# Altium schematic sheet MAIN.SchDoc: Main
size 431 x 279 mm; Date: 02/15/2021; CompanyName: University of Pennsylvania; DrawnBy: Team KOIN; DocumentNumber: 1; Revision: 2; SheetNumber: 1; SheetTotal: 8
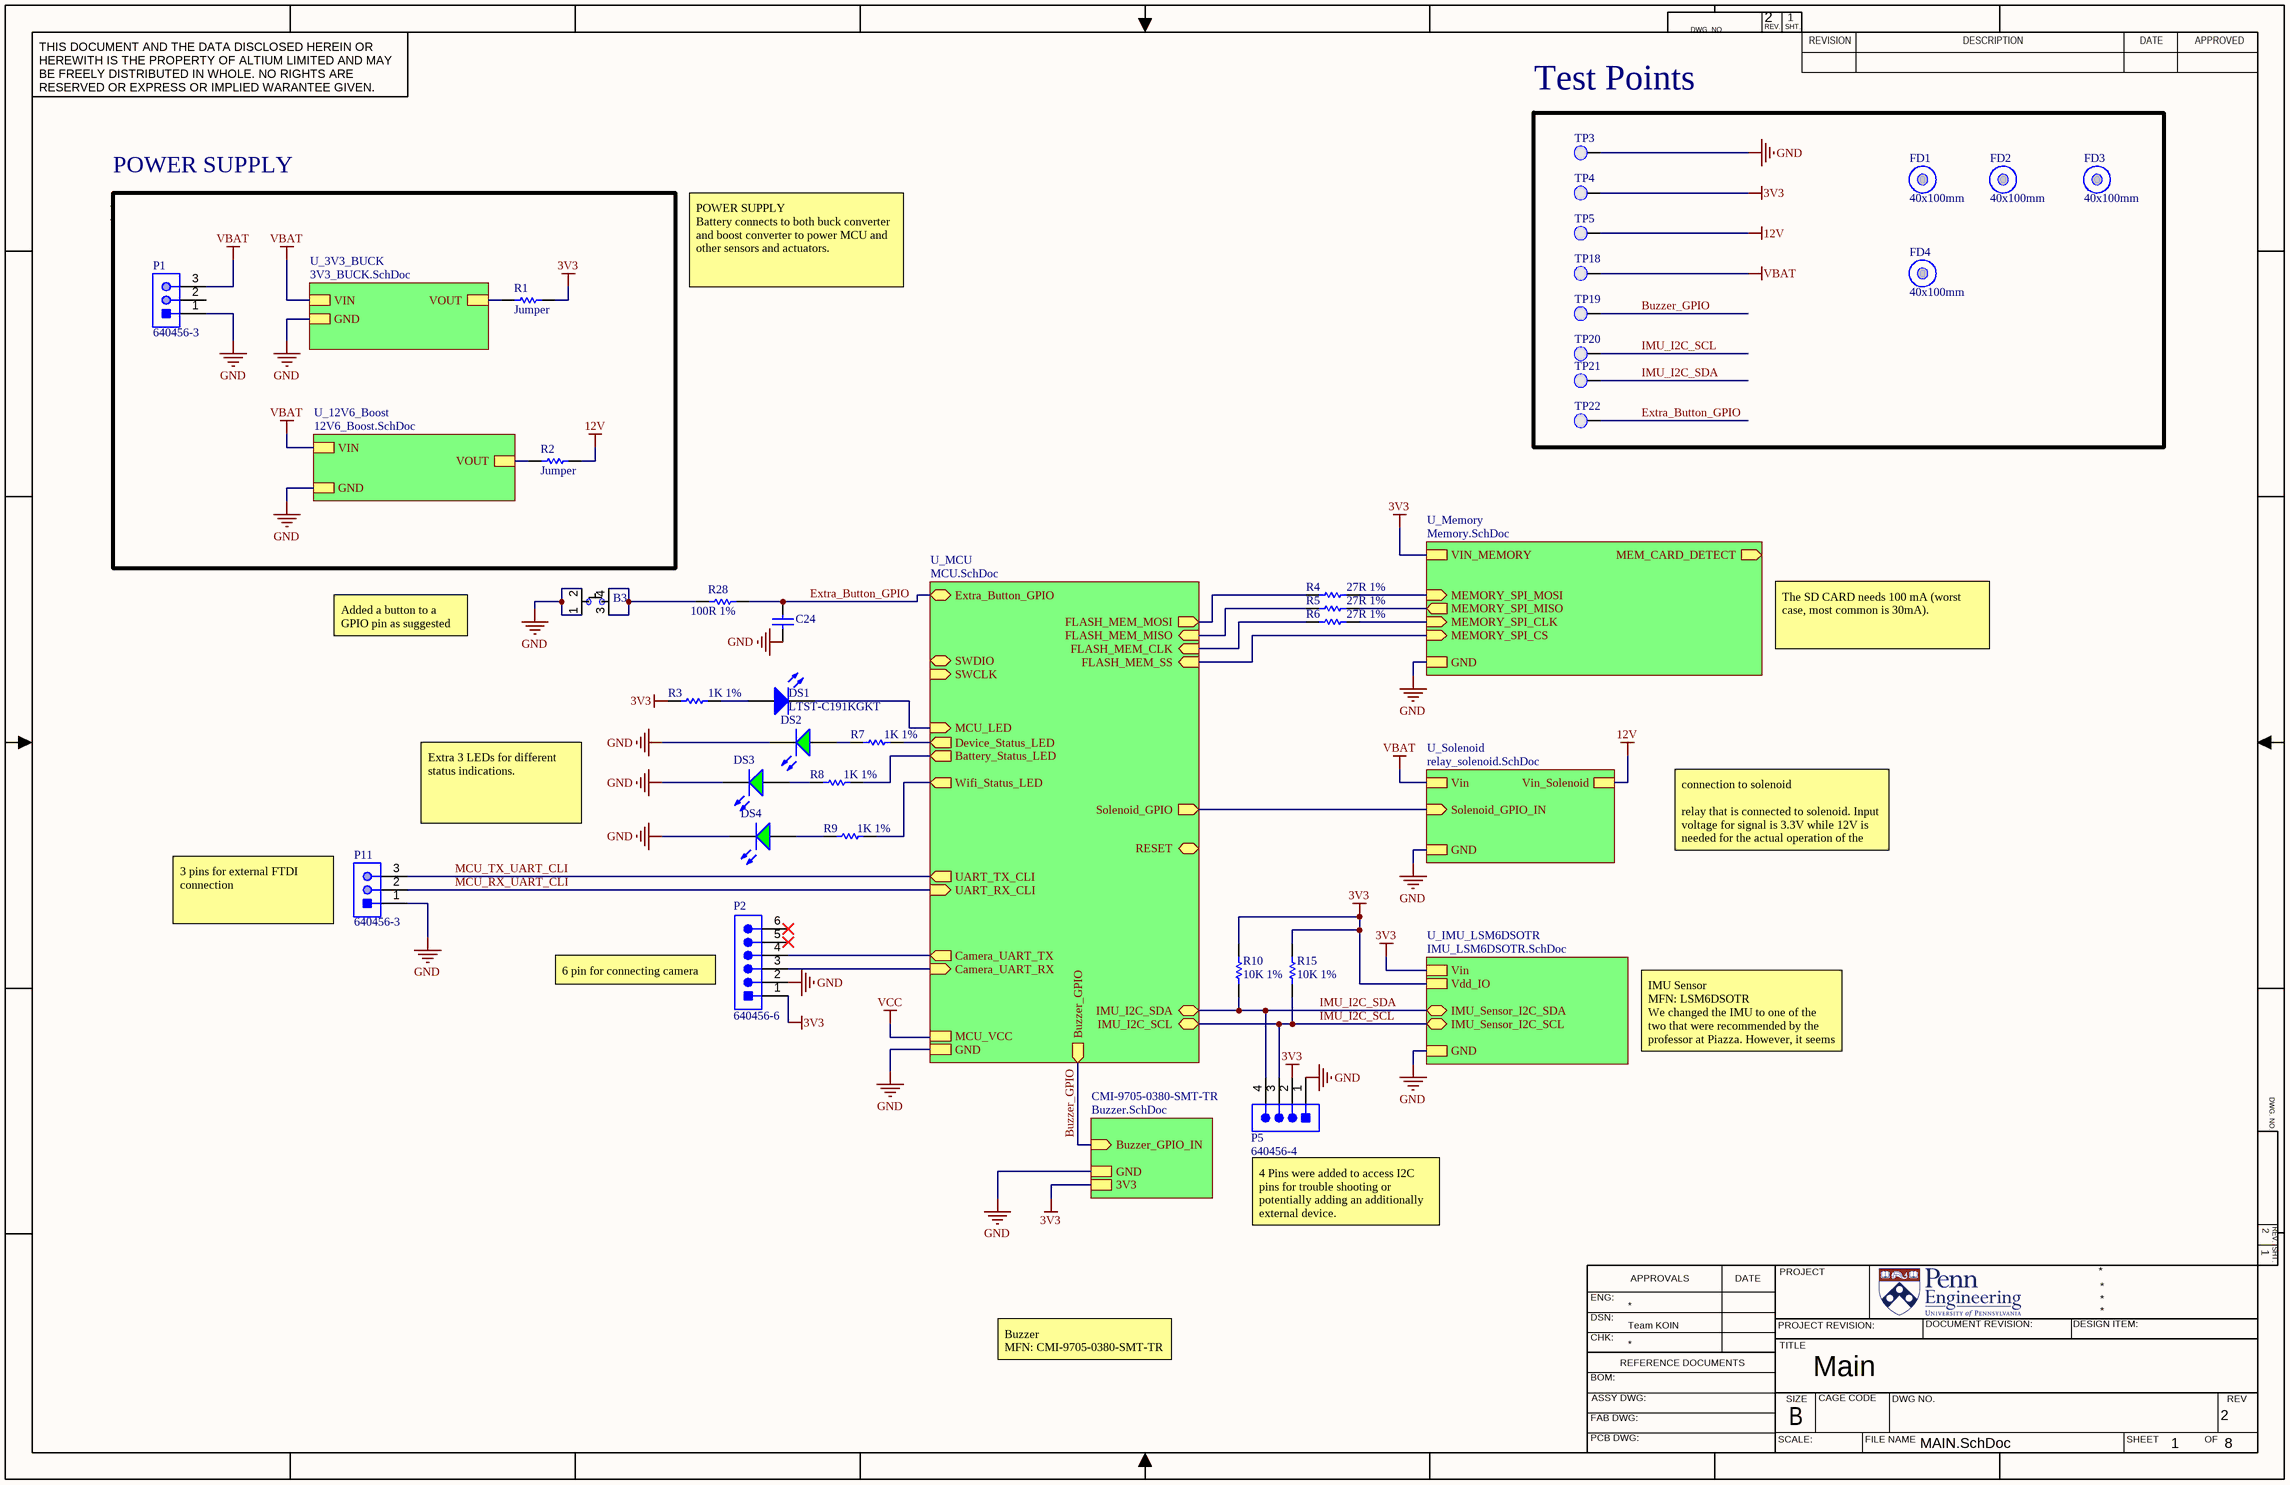
[diagram p0: MAIN.SchDoc]

## Parts
B3  PTS810 SJK 250 SMTR LFS  [PTS810 SJK 250 SMTR LFS]  (value not drawn)
C24  CAP 1uF 16V 0603(1608)  [CAPC0603(1608)100_N]  (value not drawn)
DS1  LTST-C191KGKT  [LITE-ON-LTST-C191KRKT-2_V]
DS2  (no value)  [LTST-C170GKT_V]
DS3  (no value)  [LTST-C170GKT_V]
DS4  (no value)  [LTST-C170GKT_V]
FD1  40x100mm  [Fiducial_FT]
FD2  40x100mm  [Fiducial_FT]
FD3  40x100mm  [Fiducial_FT]
FD4  40x100mm  [Fiducial_FT]
P1  640456-3  [TECO-640456-3]
P2  640456-6  [TECO-640456-6_V]
P5  640456-4  [TECO-640456-4]
P11  640456-3  [TECO-640456-3]
R1  Jumper  [RESC0805(2012)_N]
R2  Jumper  [RESC0805(2012)_N]
R3  1K 1%  [RESC0603(1608)_N]
R4  27R 1%  [RESC0603(1608)_N]
R5  27R 1%  [RESC0603(1608)_N]
R6  27R 1%  [RESC0603(1608)_N]
R7  1K 1%  [RESC0603(1608)_M]
R8  1K 1%  [RESC0603(1608)_M]
R9  1K 1%  [RESC0603(1608)_M]
R10  10K 1%  [RESC0603(1608)_N]
R15  10K 1%  [RESC0603(1608)_N]
R28  100R 1%  [RESC0603(1608)_N]
TP3  0.1" Pad  [PCBComponent]  (value not drawn)
TP4  0.1" Pad  [PCBComponent]  (value not drawn)
TP5  0.1" Pad  [PCBComponent]  (value not drawn)
TP18  0.1" Pad  [PCBComponent]  (value not drawn)
TP19  0.1" Pad  [PCBComponent]  (value not drawn)
TP20  0.1" Pad  [PCBComponent]  (value not drawn)
TP21  0.1" Pad  [PCBComponent]  (value not drawn)
TP22  0.1" Pad  [PCBComponent]  (value not drawn)

## Blocks framed on the sheet
Test Points: FD1-FD4 TP3-TP5 TP18-TP22

## Sub-sheets
CMI-9705-0380-SMT-TR = Buzzer.SchDoc: Buzzer_GPIO_IN (in), 3V3, GND
U_3V3_BUCK = 3V3_BUCK.SchDoc: VOUT, VIN, GND
U_12V6_Boost = 12V6_Boost.SchDoc: VOUT, VIN, GND
U_IMU_LSM6DSOTR = IMU_LSM6DSOTR.SchDoc: Vin, GND, IMU_Sensor_I2C_SCL (bidir), IMU_Sensor_I2C_SDA (bidir), Vdd_IO
U_MCU = MCU.SchDoc: SWDIO (bidir), SWCLK (in), UART_TX_CLI (out), UART_RX_CLI (in), FLASH_MEM_SS (in), FLASH_MEM_CLK (in), FLASH_MEM_MISO (in), FLASH_MEM_MOSI (out), RESET (bidir), MCU_LED (in), MCU_VCC, GND, IMU_I2C_SCL (bidir), IMU_I2C_SDA (bidir), Camera_UART_RX (in), Camera_UART_TX (out), Device_Status_LED (out), Battery_Status_LED (out), Wifi_Status_LED (out), Buzzer_GPIO (out), Solenoid_GPIO (out), Extra_Button_GPIO (bidir)
U_Memory = Memory.SchDoc: VIN_MEMORY, MEMORY_SPI_MOSI (in), MEMORY_SPI_MISO (out), MEMORY_SPI_CLK (in), MEMORY_SPI_CS (in), MEM_CARD_DETECT (out), GND
U_Solenoid = relay_solenoid.SchDoc: Solenoid_GPIO_IN (in), Vin, GND, Vin_Solenoid

## Nets
3V3: P2.1 P5.2 R1.2 R3.1 R10.2 R15.2 TP4.1(PAD) ; sheet U_Memory/VIN_MEMORY, sheet U_IMU_LSM6DSOTR/Vin, sheet U_IMU_LSM6DSOTR/Vdd_IO, sheet CMI-9705-0380-SMT-TR/3V3
12V: R2.2 TP5.1(PAD) ; sheet U_Solenoid/Vin_Solenoid
GND: B3.1 B3.2 C24.1 DS2.2(K) DS3.2(K) DS4.2(K) P1.1 P2.2 P5.1 P11.1 TP3.1(PAD) ; sheet U_MCU/GND, sheet U_Memory/GND, sheet U_3V3_BUCK/GND, sheet U_12V6_Boost/GND, sheet U_Solenoid/GND, sheet U_IMU_LSM6DSOTR/GND, sheet CMI-9705-0380-SMT-TR/GND
VBAT: P1.3 TP18.1(PAD) ; sheet U_3V3_BUCK/VIN, sheet U_12V6_Boost/VIN, sheet U_Solenoid/Vin
Buzzer_GPIO: TP19.1(PAD) ; sheet U_MCU/Buzzer_GPIO, sheet CMI-9705-0380-SMT-TR/Buzzer_GPIO_IN
Extra_Button_GPIO: C24.2 R28.2 TP22.1(PAD) ; sheet U_MCU/Extra_Button_GPIO
IMU_I2C_SCL: P5.3 R15.1 TP20.1(PAD) ; sheet U_MCU/IMU_I2C_SCL, sheet U_IMU_LSM6DSOTR/IMU_Sensor_I2C_SCL
IMU_I2C_SDA: P5.4 R10.1 TP21.1(PAD) ; sheet U_MCU/IMU_I2C_SDA, sheet U_IMU_LSM6DSOTR/IMU_Sensor_I2C_SDA
MCU_RX_UART_CLI: P11.2 ; sheet U_MCU/UART_RX_CLI
MCU_TX_UART_CLI: P11.3 ; sheet U_MCU/UART_TX_CLI
NetB3_3: B3.3 B3.4 R28.1
NetDS1_1: DS1.1(A) R3.2
NetDS1_2: DS1.2(K) ; sheet U_MCU/MCU_LED
NetDS2_1: DS2.1(A) R7.2
NetDS3_1: DS3.1(A) R8.2
NetDS4_1: DS4.1(A) R9.1
NetP2_3: P2.3 ; sheet U_MCU/Camera_UART_RX
NetP2_4: P2.4 ; sheet U_MCU/Camera_UART_TX
NetR1_1: R1.1 ; sheet U_3V3_BUCK/VOUT
NetR2_1: R2.1 ; sheet U_12V6_Boost/VOUT
NetR4_1: R4.1 ; sheet U_MCU/FLASH_MEM_MOSI
NetR4_2: R4.2 ; sheet U_Memory/MEMORY_SPI_MOSI
NetR5_1: R5.1 ; sheet U_MCU/FLASH_MEM_MISO
NetR5_2: R5.2 ; sheet U_Memory/MEMORY_SPI_MISO
NetR6_1: R6.1 ; sheet U_MCU/FLASH_MEM_CLK
NetR6_2: R6.2 ; sheet U_Memory/MEMORY_SPI_CLK
NetR7_1: R7.1 ; sheet U_MCU/Device_Status_LED
NetR8_1: R8.1 ; sheet U_MCU/Battery_Status_LED
NetR9_2: R9.2 ; sheet U_MCU/Wifi_Status_LED
(unnamed): sheet U_MCU/FLASH_MEM_SS, sheet U_Memory/MEMORY_SPI_CS
(unnamed): sheet U_MCU/Solenoid_GPIO, sheet U_Solenoid/Solenoid_GPIO_IN

Not connected (* = marked no-connect by the designer): P1 2; P2 5* 6*

## Notes on the sheet
- POWER SUPPLY
- POWER SUPPLY
  Battery connects to both buck converter and boost converter to power MCU and other sensors and actuators.
- Added a button to a GPIO pin as suggested by the professor
- The SD CARD needs 100 mA (worst case, most common is 30mA).
- Extra 3 LEDs for different status indications.
- connection to solenoid
  relay that is connected to solenoid. Input voltage for signal is 3.3V while 12V is needed for the actual operation of the solenoid. (Please check the realy_solenoid.SchDoc for the details)
- (near P11) 3 pins for external FTDI connection
- (near P2) 6 pin for connecting camera
- IMU Sensor
  MFN: LSM6DSOTR
  We changed the IMU to one of the two that were recommended by the professor at Piazza. However, it seems it is out-of-stock (both recommended IMUs are out-of-stock)
- 4 Pins were added to access I2C pins for trouble shooting or potentially adding an additionally external device.
- Buzzer
  MFN: CMI-9705-0380-SMT-TR
- DWG. NO.
- REV.
- SHT.
- THIS DOCUMENT AND THE DATA DISCLOSED HEREIN OR HEREWITH IS THE PROPERTY OF ALTIUM LIMITED AND MAY BE FREELY DISTRIBUTED IN WHOLE. NO RIGHTS ARE RESERVED OR EXPRESS OR IMPLIED WARANTEE GIVEN.
- REVISION
- DESCRIPTION
- DATE
- APPROVED
- ENG:
- APPROVALS
- PROJECT
- DSN:
- CHK:
- REFERENCE DOCUMENTS
- PROJECT REVISION:
- TITLE
- DOCUMENT REVISION:
- DESIGN ITEM:
- BOM:
- FAB DWG:
- PCB DWG:
- ASSY DWG:
- SCALE:
- SIZE
- B
- CAGE CODE
- FILE NAME
- DWG NO.
- SHEET
- OF
- REV

## Library data of the parts
B3 = PTS810 SJK 250 SMTR LFS: SWITCH TACTILE SPST-NO 0.05A 16V Tactile Switch SPST-NO Top Actuated Surface Mount; Manufacturer: ITT /  C&K Components; Part # Aliases: Y97LT25B5DBFP; Operating Force: 2.6 N; Actuator: Oval; Current Rating: 50 mA; Voltage Rating DC: 16 VDC; Contact Form: SPST; Switch Function: OFF - (ON); Mounting Direction: Straight; Stem Height: 2.5 mm; Brand: C&K Components; Travel: 0.15 mm; Manufacturer Part Number: PTS810SJK250SMTRLFS; Product Category: Tactile Switches; RoHS: Details; Termination Style: J Form Lead; Mounting Style: SMD/SMT; Color: White; Packaging: Reel; Contact Plating: Silver; Operating Temperature Range: - 40 C to + 85 C; Series: PTS810; Factory Pack Quantity: 2900; ComponentLink1URL: https://datasheet.ciiva.com/18514/pts810-4mar13-18514061.pdf; ComponentLink1Description: https://datasheet.ciiva.com/18514/pts810-4mar13-18514061.pdf; ComponentLink2URL: https://datasheet.ciiva.com/18514/pts810-4mar13-18514062.pdf; ComponentLink2Description: https://datasheet.ciiva.com/18514/pts810-4mar13-18514062.pdf; ComponentLink3URL: https://datasheet.ciiva.com/18514/pts810-4mar13-18514063.pdf; ComponentLink3Description: https://datasheet.ciiva.com/18514/pts810-4mar13-18514063.pdf; Supplier 1: Digi-Key; Supplier Part Number 1: CKN10503CT-ND
C24 = CMP-1035-02736-1: CAP 1uF 16V ±5% 0603 (1608 Metric) Thickness 1mm SMD; Case-Metric: 1608; Case-EIA: 0603; Tolerance: Â±5%; Technology: SMT; Max Thickness: 1 mm; Rated Voltage: 16 V; Value: 1uF
DS1 = CMP-2000-05198-1: Chip LED, Green, 574 nm, 40 pF, -55 to 85 degC, 2-Pin SMD, RoHS, Tape and Reel; Manufacturer: Lite-On; Rad Hardened: No; Emitting Color: YellowGreen; Product Height (mm): 0.55mm; Forward Voltage: 2.4V; Number of Elements: 1; Dominant Wave Length: 571nm; DELETED: Compliant; Viewing Angle: 130deg; High Brightness: Yes; Peak Wavelength: 574nm; Type: Uni-Color; Forward Current: 30mA; Product Length (mm): 1.6mm; Luminous Intensity: 35mcd; Test Current (It): 20mA; Chip Material: AlGaInP; Product Depth (mm): 0.8mm; Shape Type: Rectangular; Reverse Voltage: 5V; Power Dissipation: 75W; Pin Count: 2; Lens Dimensions: 1.1X0.8X0.37mm; Packaging: TapeandReel; Main Category: ChipLED; Operating Temperature Classification: Industrial; Package Type: ChipLed; Mounting: SurfaceMount; Lum Intensity: 35mcd; Operating Temp Range: -55Cto85C; Datasheet Version: Jan-07; Datasheet URL: http://download.siliconexpert.com/pdfs/2007/08/26/semi_b/manual/lot/ds/ltst-c191kgkt.pdf; Manufacturer URL: http://www.us.liteon.com/
DS2-DS4 = CMP-1674-00002-5: LED Uni-Color Green, 100 mW, 120 mA, -55 to 85 degC, 2-Pin SMD, RoHS, Tape and Reel; Manufacturer: Lite-On; ComponentLink1URL: http://www.us.liteon.com/; Height: 1.1 mm; PackageDescription: 2-Pin Surface Mount Device, Body 2 x 1.25 mm; RoHSCompliant: true; Package Quantity: 1; Packaging: Tape and Reel; Mount: Surface Mount; Min Operating Temperature: -55 degC; DatasheetVersion: 03/2003; Max Operating Temperature: 85 degC; ComponentLink1Description: Manufacturer URL; Pins: 2; Mounting Technology: Surface Mount; Length: 2 mm; Colour: Green; PackageReference: C170GKT; ComponentLink2URL: http://media.digikey.com/pdf/Data%20Sheets/Lite-On%20PDFs/LTST-C170GKT.pdf; ComponentLink2Description: Datasheet
FD1-FD4 = CMP-00174-A.4: Fiducial 40x100mm
P1 P11 = CMP-2000-05418-1: Male Header, Pitch 2.54 mm, 1 x 3 Position, Height 10.03 mm, Tail Length 3.56 mm, -55 to 105 degC; Manufacturer: TE Connectivity; Agency Approvals: CSA,UL; Angle: Straight; Number of Positions: 3; Standards: RoHSCompliant,ELVCompliant,UL94V-0; Current, Rating: 5 / A; Connector Type: MTA-100; Mount Angle: Vertical; Material, Housing: Polyester; Temperature, Operating: -55to+105 / degC; Voltage, Rating: 250 / V; Color, Housing: White; Contact Centerline Spacing: 0.100 / in.; Special Features: Pinstrip; Material, Contact: CopperAlloy; Contact Termination Area Plating: Tin; Primary Type: InterconnectSystem; Pin Spacing: 0.1 / "; Brand/Series: MTA-100Series; Mounting Hole Size: 0.04 / "; Manufacturer URL: http://www.te.com/; Datasheet URL: https://datasheet.ciiva.com/16456/eng-ds-82056-mta-0608-16456886.pdf; Flammability Rating: UL94V-0; Mounting Type: PCMount; Contact Mating Area Plating: Tin; Datasheet Version: Jun-08; Number of Rows: 1; Termination: Solder; Type: PCBPlug; Length, Pin: 0.14 / "; Color: White; Contact Plating: Tin; Contact Shape: Square; Number of Contacts: 3; Size, Post: 0.025 / in.; Length, Terminal Post: 0.14 / in.; Length, Overall: 0.3 / "
P2 = CMP-2000-05661-1: Male Header, Pitch 2.54 mm, 1 x 6 Position, Height 10.03 mm, Tail Length 3.56 mm, -55 to 105 degC, Bulk; Manufacturer: TE Connectivity; Contact Centerline Spacing: 0.100 / in.; Number of Contacts: 6; Current, Rating: 5 / A; Agency Approvals: CSA,UL; Material, Contact: CopperAlloy; Brand/Series: MTA-100Series; Mount Angle: Vertical; Contact Termination Area Plating: Tin; Angle: Straight; Primary Type: InterconnectSystem; Standards: RoHSCompliant,ELVCompliant,UL94V-0; Temperature, Operating: -55to+105 / °C; Material, Housing: Polyester; Special Features: Pinstrip; Color, Housing: White; Connector Type: MTA-100; Voltage, Rating: 250 / V; Termination: Solder; Package Reference: 640456-6; Size, Post: 0.025 / in.; Color: White; Datasheet URL: https://datasheet.ciiva.com/25618/0900766b80eb7fdd-25618163.pdf; Manufacturer URL: http://www.te.com/; Mounting Type: PCMount; Type: PCBPlug; Mounting Technology: ThroughHole; Number of Rows: 1; Contact Shape: Square; Contact Mating Area Plating: Tin; Datasheet Version: Rev. W, 05/2005; Number of Positions: 6; Package Description: Male Header, Pitch 2.54 mm, 1 x 6 Position, Height 10.03 mm, Tail Length 3.56 mm; Contact Plating: Tin; Length, Terminal Post: 0.14 / in.; Flammability Rating: UL94V-0
P5 = CMP-2000-05419-1: Male Header, Pitch 2.54 mm, 1 x 4 Position, Height 10.03 mm, Tail Length 3.56 mm, RoHS, Bulk; Manufacturer: TE Connectivity; Material, Housing: Polyester; Primary Type: InterconnectSystem; Mount Angle: Vertical; Color, Housing: White; Current, Rating: 5 / A; Agency Approvals: CSA,UL; Contact Termination Area Plating: Tin; Temperature, Operating: -55to+105 / degC; Standards: RoHSCompliant,ELVCompliant,UL94V-0; Number of Positions: 4; Brand/Series: MTA-100Series; Angle: Straight; Pin Spacing: 0.1 / "; Material, Contact: CopperAlloy; Connector Type: MTA-100; Special Features: Pinstrip; Mounting Hole Size: 0.04 / "; Contact Centerline Spacing: 0.100 / in.; Voltage, Rating: 250 / V; Manufacturer URL: http://www.te.com/; Length, Pin: 0.14 / "; Length, Overall: 0.4 / "; Color: White; Flammability Rating: UL94V-0; Mounting Type: PCMount; Termination: Solder; Datasheet URL: https://datasheet.ciiva.com/16286/eng-ds-82056-mta-0608-16286228.pdf; Number of Contacts: 4; Contact Shape: Square; Contact Mating Area Plating: Tin; Length, Terminal Post: 0.14 / in.; Size, Post: 0.025 / in.; Contact Plating: Tin; Type: PCBPlug; Datasheet Version: Dec-14; Number of Rows: 1
R1 R2 = CMP-1013-00001-1: Jumper 0805 (2012 Metric); Case-EIA: 0805; Value: 0.00 Ohm; Tolerance: None; Case-Metric: 2012; Technology: SMT; Power: None
R3 R7-R9 = CMP-1012-00510-1: 1K 0.1W 1% 0603 (1608 Metric)  SMD; Case-Metric: 1608; Case-EIA: 0603; Value: 1000.00 Ohm; Technology: SMT; Tolerance: 1 %; Power: 0.1 W
R4-R6 = CMP-1012-00331-1: 27R 0.1W 1% 0603 (1608 Metric)  SMD; Case-EIA: 0603; Value: 27.00 Ohm; Case-Metric: 1608; Technology: SMT; Tolerance: 1 %; Power: 0.1 W
R10 R15 = CMP-1012-00623-1: 10K 0.1W 1% 0603 (1608 Metric)  SMD; Value: 10000.00 Ohm; Case-EIA: 0603; Case-Metric: 1608; Power: 0.1 W; Tolerance: 1 %; Technology: SMT
R28 = CMP-1012-00397-1: 100R 0.1W 1% 0603 (1608 Metric)  SMD; Value: 100.00 Ohm; Case-EIA: 0603; Case-Metric: 1608; Technology: SMT; Tolerance: 1 %; Power: 0.1 W
TP3-TP5 TP18-TP22 = 0.1" Pad-A.4